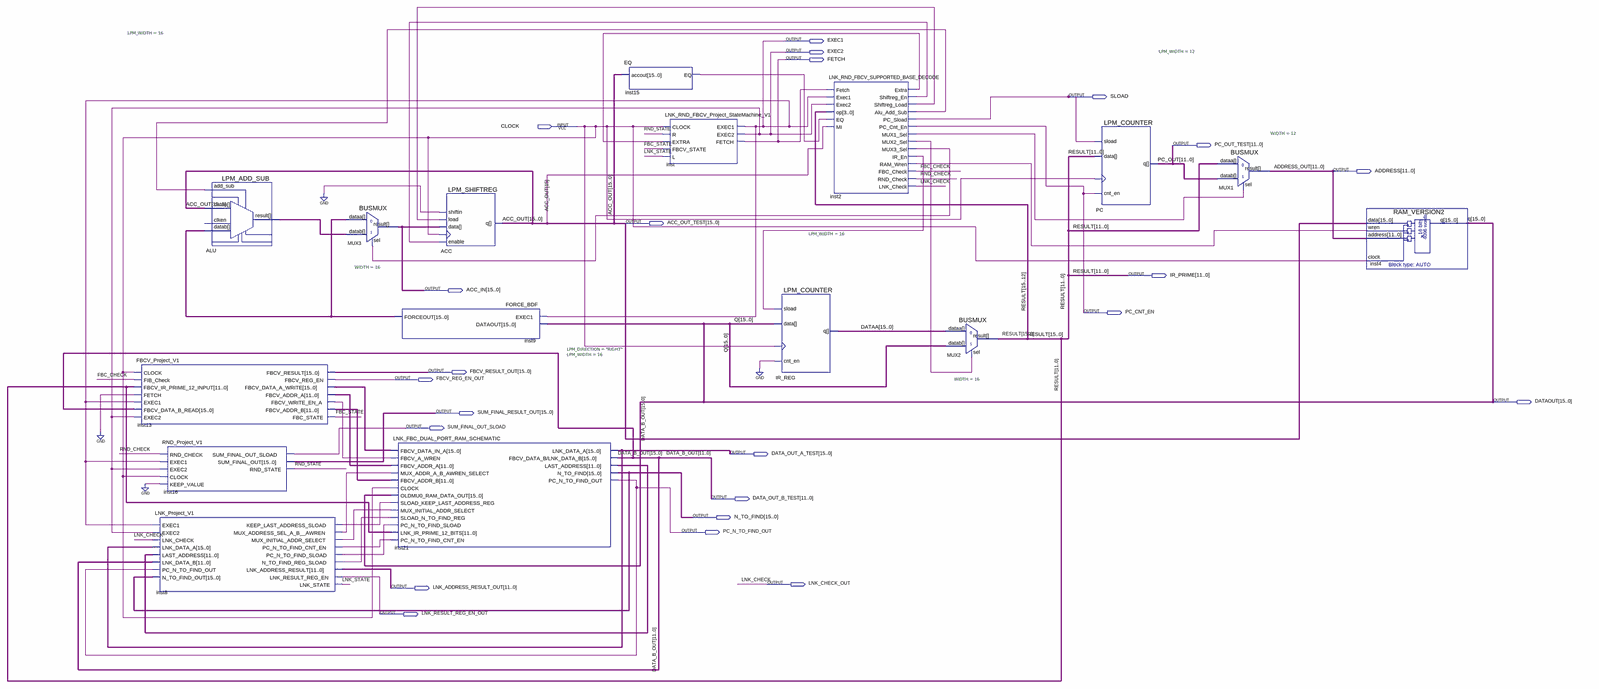
[diagram p0: schematic sheet, whole]
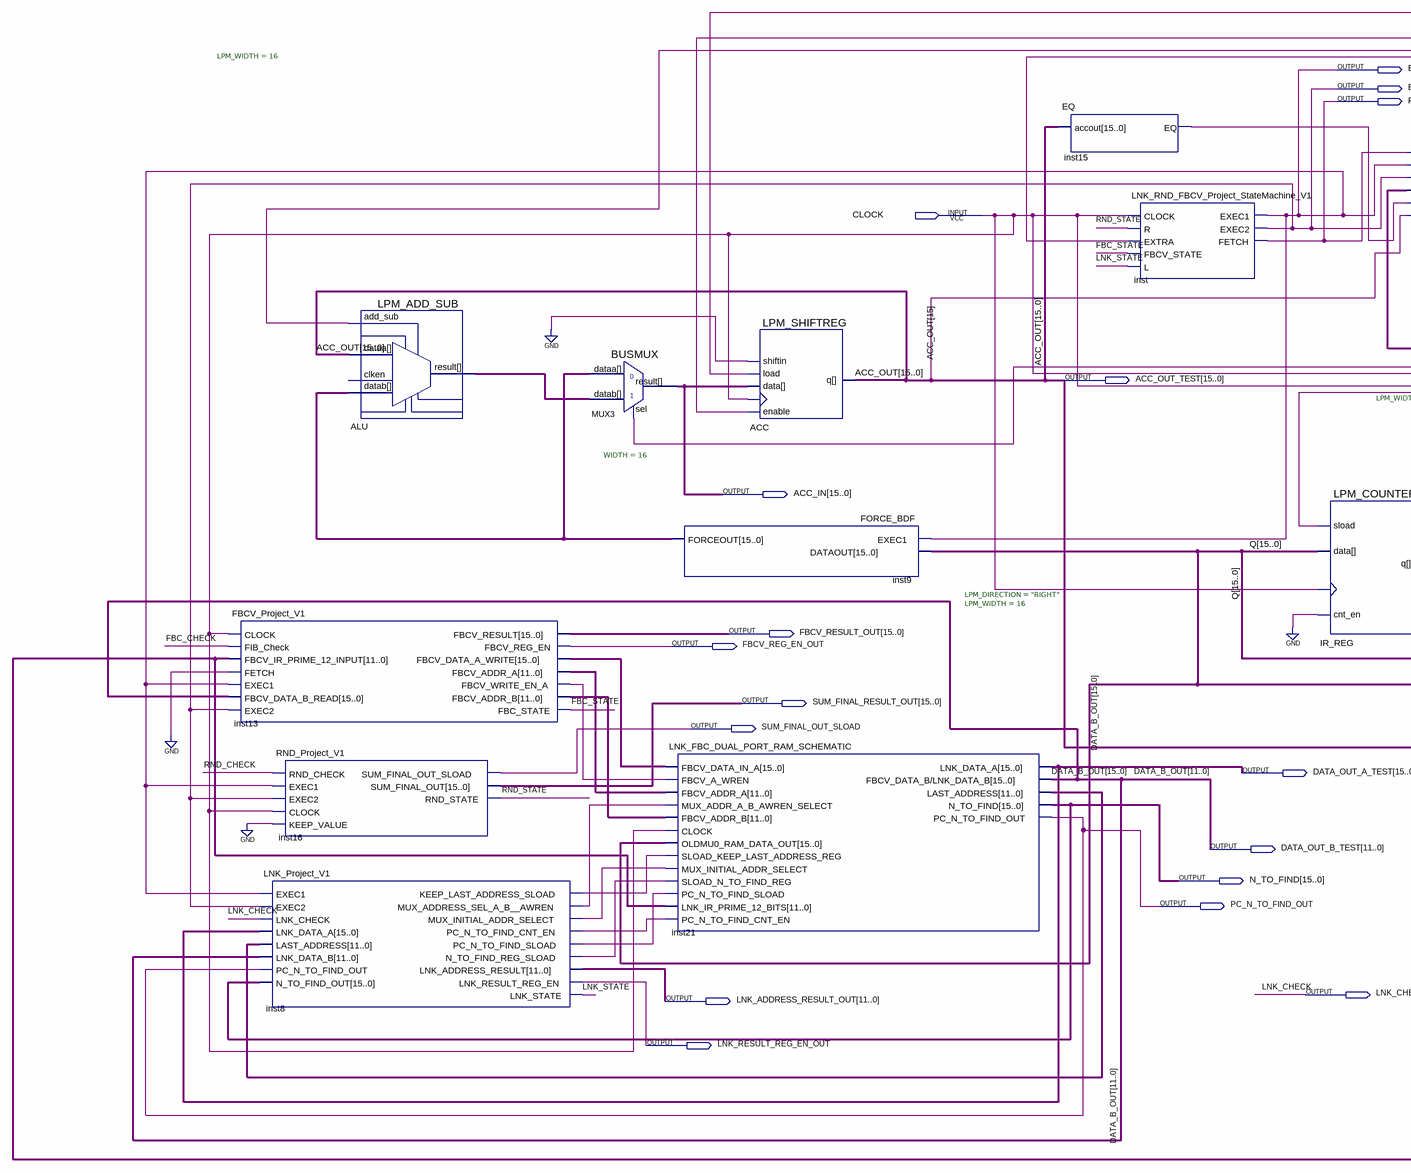
[diagram p1: schematic sheet, left part]
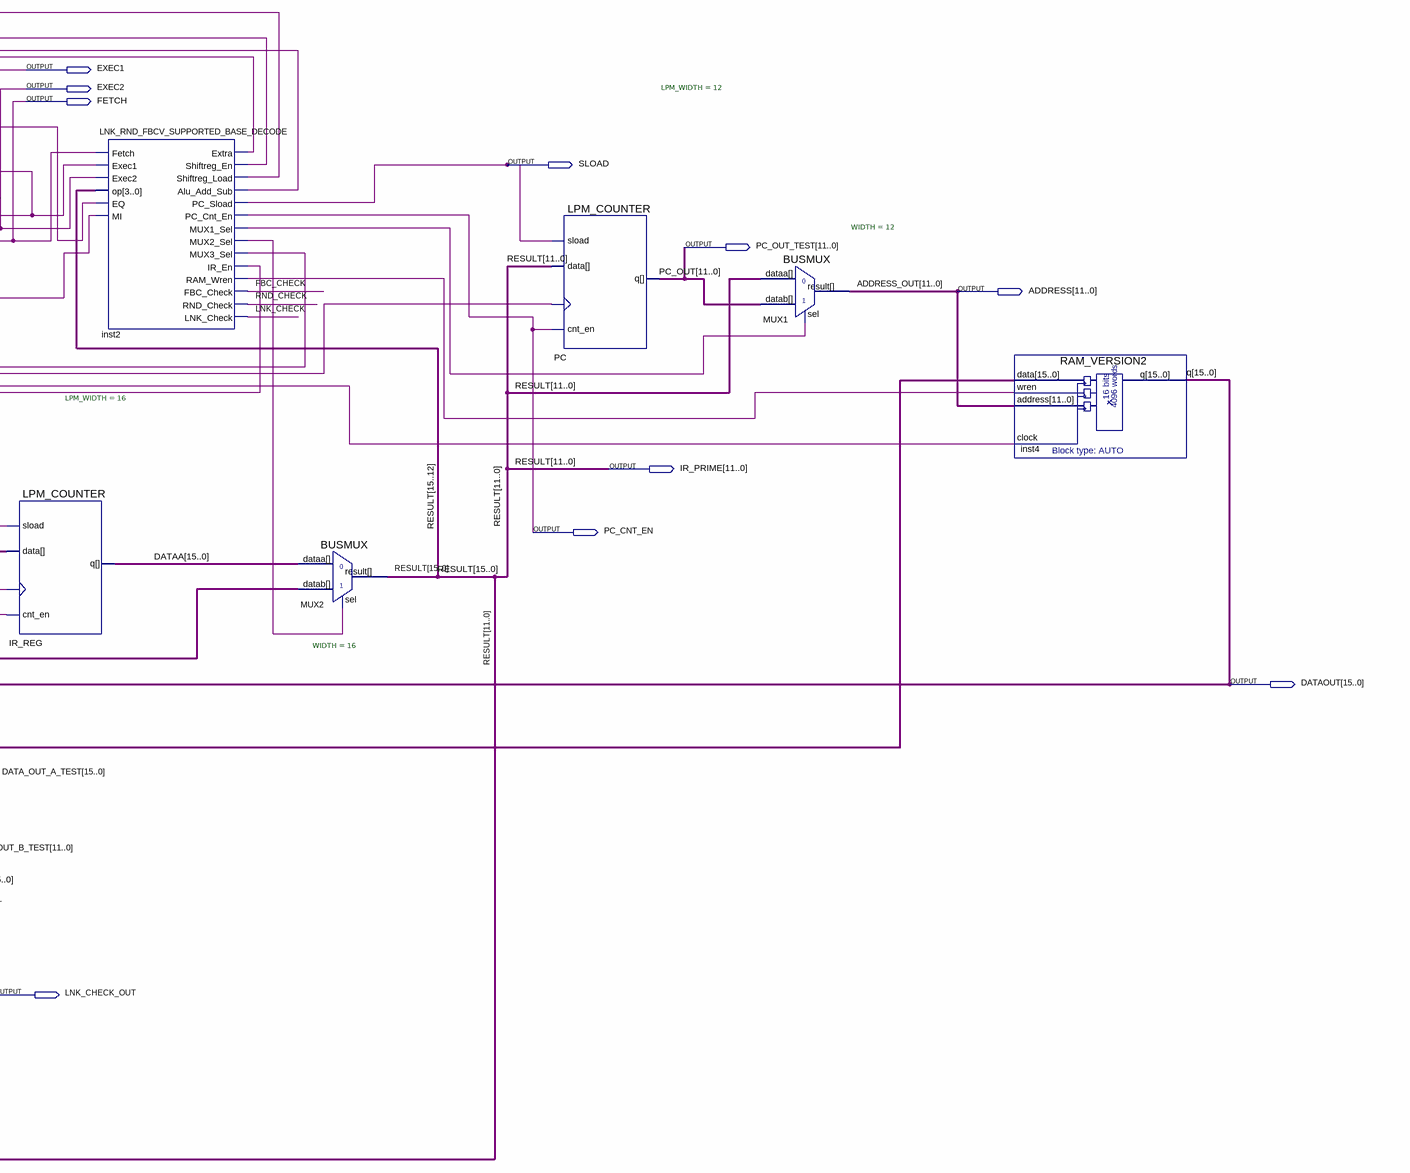
[diagram p2: schematic sheet, right part]
// Quartus schematic LNK_RND_FBCV_Project_MU0_Basic_V1.bdf as structural Verilog: 16 symbols, 23 pins
module LNK_RND_FBCV_Project_MU0_Basic_V1 (
  input  CLOCK,
  output EXEC1,
  output EXEC2,
  output FETCH,
  output SLOAD,
  output [11:0] PC_OUT_TEST,
  output [11:0] ADDRESS,
  output [15:0] ACC_OUT_TEST,
  output [11:0] IR_PRIME,
  output [15:0] ACC_IN,
  output PC_CNT_EN,
  output [15:0] FBCV_RESULT_OUT,
  output FBCV_REG_EN_OUT,
  output [15:0] DATAOUT,
  output [15:0] SUM_FINAL_RESULT_OUT,
  output SUM_FINAL_OUT_SLOAD,
  output [15:0] DATA_OUT_A_TEST,
  output [11:0] DATA_OUT_B_TEST,
  output [15:0] N_TO_FIND,
  output PC_N_TO_FIND_OUT,
  output LNK_CHECK_OUT,
  output [11:0] LNK_ADDRESS_RESULT_OUT,
  output LNK_RESULT_REG_EN_OUT
);

  wire FBC_CHECK, FBC_STATE, inst2_alu_add_sub, inst2_extra, inst2_ir_en, inst2_mux1_sel, inst2_mux2_sel,
       inst2_mux3_sel, inst2_ram_wren, inst2_shiftreg_en, inst2_shiftreg_load, inst8_keep_last_address_sload,
       inst8_mux_address_sel_a_b__awren, inst8_mux_initial_addr_select, inst8_n_to_find_reg_sload,
       inst8_pc_n_to_find_cnt_en, inst8_pc_n_to_find_sload, inst13_fbcv_write_en_a, inst15_eq, LNK_STATE,
       RND_CHECK, RND_STATE;
  wire [11:0] inst13_fbcv_addr_a, inst13_fbcv_addr_b, inst21_last_address;
  wire [15:0] ALU_result, DATAA, inst9_forceout, inst13_fbcv_data_a_write;
  wire [15:12] DATA_B_OUT, RESULT;

  FBCV_Project_V1 inst13 (
    .CLOCK(CLOCK), .FIB_Check(FBC_CHECK), .FBCV_IR_PRIME_12_INPUT(IR_PRIME), .FETCH(1'b0), .EXEC1(EXEC1),
    .FBCV_DATA_B_READ({DATA_B_OUT, DATA_OUT_B_TEST}), .EXEC2(EXEC2), .FBCV_RESULT(FBCV_RESULT_OUT),
    .FBCV_REG_EN(FBCV_REG_EN_OUT), .FBCV_DATA_A_WRITE(inst13_fbcv_data_a_write),
    .FBCV_ADDR_A(inst13_fbcv_addr_a), .FBCV_WRITE_EN_A(inst13_fbcv_write_en_a),
    .FBCV_ADDR_B(inst13_fbcv_addr_b), .FBC_STATE(FBC_STATE));
  LNK_Project_V1 inst8 (
    .EXEC1(EXEC1), .EXEC2(EXEC2), .LNK_CHECK(LNK_CHECK_OUT), .LNK_DATA_A(DATA_OUT_A_TEST),
    .LAST_ADDRESS(inst21_last_address), .LNK_DATA_B(DATA_OUT_B_TEST), .PC_N_TO_FIND_OUT(PC_N_TO_FIND_OUT),
    .N_TO_FIND_OUT(N_TO_FIND), .KEEP_LAST_ADDRESS_SLOAD(inst8_keep_last_address_sload),
    .MUX_ADDRESS_SEL_A_B__AWREN(inst8_mux_address_sel_a_b__awren),
    .MUX_INITIAL_ADDR_SELECT(inst8_mux_initial_addr_select), .PC_N_TO_FIND_CNT_EN(inst8_pc_n_to_find_cnt_en),
    .PC_N_TO_FIND_SLOAD(inst8_pc_n_to_find_sload), .N_TO_FIND_REG_SLOAD(inst8_n_to_find_reg_sload),
    .LNK_ADDRESS_RESULT(LNK_ADDRESS_RESULT_OUT), .LNK_RESULT_REG_EN(LNK_RESULT_REG_EN_OUT),
    .LNK_STATE(LNK_STATE));
  RND_Project_V1 inst16 (
    .RND_CHECK(RND_CHECK), .EXEC1(EXEC1), .EXEC2(EXEC2), .CLOCK(CLOCK), .KEEP_VALUE(1'b0),
    .SUM_FINAL_OUT_SLOAD(SUM_FINAL_OUT_SLOAD), .SUM_FINAL_OUT(SUM_FINAL_RESULT_OUT), .RND_STATE(RND_STATE));
  LPM_ADD_SUB #(.LPM_WIDTH(16)) ALU (
    .add_sub(inst2_alu_add_sub), .dataa(ACC_OUT_TEST), .datab(inst9_forceout), .result(ALU_result));  // open: clken
  BUSMUX #(.WIDTH(16)) MUX3 (.datab(ALU_result), .sel(inst2_mux3_sel), .dataa(inst9_forceout), .result(ACC_IN));
  FORCE_BDF inst9 (.EXEC1(EXEC1), .DATAOUT(DATAOUT), .FORCEOUT(inst9_forceout));
  LNK_FBC_DUAL_PORT_RAM_SCHEMATIC inst21 (
    .FBCV_DATA_IN_A(inst13_fbcv_data_a_write), .FBCV_A_WREN(inst13_fbcv_write_en_a),
    .FBCV_ADDR_A(inst13_fbcv_addr_a), .MUX_ADDR_A_B_AWREN_SELECT(inst8_mux_address_sel_a_b__awren),
    .FBCV_ADDR_B(inst13_fbcv_addr_b), .CLOCK(CLOCK), .OLDMU0_RAM_DATA_OUT(DATAOUT),
    .SLOAD_KEEP_LAST_ADDRESS_REG(inst8_keep_last_address_sload),
    .MUX_INITIAL_ADDR_SELECT(inst8_mux_initial_addr_select), .SLOAD_N_TO_FIND_REG(inst8_n_to_find_reg_sload),
    .PC_N_TO_FIND_SLOAD(inst8_pc_n_to_find_sload), .LNK_IR_PRIME_12_BITS(IR_PRIME),
    .PC_N_TO_FIND_CNT_EN(inst8_pc_n_to_find_cnt_en), .LNK_DATA_A(DATA_OUT_A_TEST),
    .\FBCV_DATA_B/LNK_DATA_B ({DATA_B_OUT, DATA_OUT_B_TEST}), .LAST_ADDRESS(inst21_last_address),
    .N_TO_FIND(N_TO_FIND), .PC_N_TO_FIND_OUT(PC_N_TO_FIND_OUT));
  LPM_SHIFTREG #(.LPM_DIRECTION("RIGHT"), .LPM_WIDTH(16)) ACC (
    .clock(CLOCK), .data(ACC_IN), .enable(inst2_shiftreg_en), .load(inst2_shiftreg_load), .shiftin(1'b0),
    .q(ACC_OUT_TEST));
  EQ inst15 (.accout(ACC_OUT_TEST), .EQ(inst15_eq));
  LNK_RND_FBCV_Project_StateMachine_V1 inst (
    .CLOCK(CLOCK), .R(RND_STATE), .EXTRA(inst2_extra), .FBCV_STATE(FBC_STATE), .L(LNK_STATE), .EXEC1(EXEC1),
    .EXEC2(EXEC2), .FETCH(FETCH));
  LPM_COUNTER #(.LPM_WIDTH(16)) IR_REG (.clock(CLOCK), .cnt_en(1'b0), .data(DATAOUT), .sload(inst2_ir_en), .q(DATAA));
  LNK_RND_FBCV_SUPPORTED_BASE_DECODE inst2 (
    .Fetch(FETCH), .Exec1(EXEC1), .Exec2(EXEC2), .op(RESULT), .EQ(inst15_eq), .MI(ACC_OUT_TEST[15]),
    .Extra(inst2_extra), .Shiftreg_En(inst2_shiftreg_en), .Shiftreg_Load(inst2_shiftreg_load),
    .Alu_Add_Sub(inst2_alu_add_sub), .PC_Sload(SLOAD), .PC_Cnt_En(PC_CNT_EN), .MUX1_Sel(inst2_mux1_sel),
    .MUX2_Sel(inst2_mux2_sel), .MUX3_Sel(inst2_mux3_sel), .IR_En(inst2_ir_en), .RAM_Wren(inst2_ram_wren),
    .FBC_Check(FBC_CHECK), .RND_Check(RND_CHECK), .LNK_Check(LNK_CHECK_OUT));
  BUSMUX #(.WIDTH(16)) MUX2 (.datab(DATAOUT), .sel(inst2_mux2_sel), .dataa(DATAA), .result({RESULT, IR_PRIME}));
  LPM_COUNTER #(.LPM_WIDTH(12)) PC (.clock(CLOCK), .cnt_en(PC_CNT_EN), .data(IR_PRIME), .sload(SLOAD), .q(PC_OUT_TEST));
  BUSMUX #(.WIDTH(12)) MUX1 (.datab(PC_OUT_TEST), .sel(inst2_mux1_sel), .dataa(IR_PRIME), .result(ADDRESS));
  RAM_VERSION2 inst4 (.data(ACC_OUT_TEST), .wren(inst2_ram_wren), .address(ADDRESS), .clock(CLOCK), .q(DATAOUT));

  // Other names for the same wires on the sheet: ACC_OUT[15:0] = ACC_OUT_TEST; ADDRESS_OUT[11:0] = ADDRESS;
  //   DATA_B_OUT[11:0] = DATA_OUT_B_TEST; q[15:0] = DATAOUT; LNK_CHECK = LNK_CHECK_OUT; PC_OUT[11:0] = PC_OUT_TEST;
  //   RESULT[11:0] = IR_PRIME
endmodule
